# EAGLE design board (EAGLE 8.6.0)
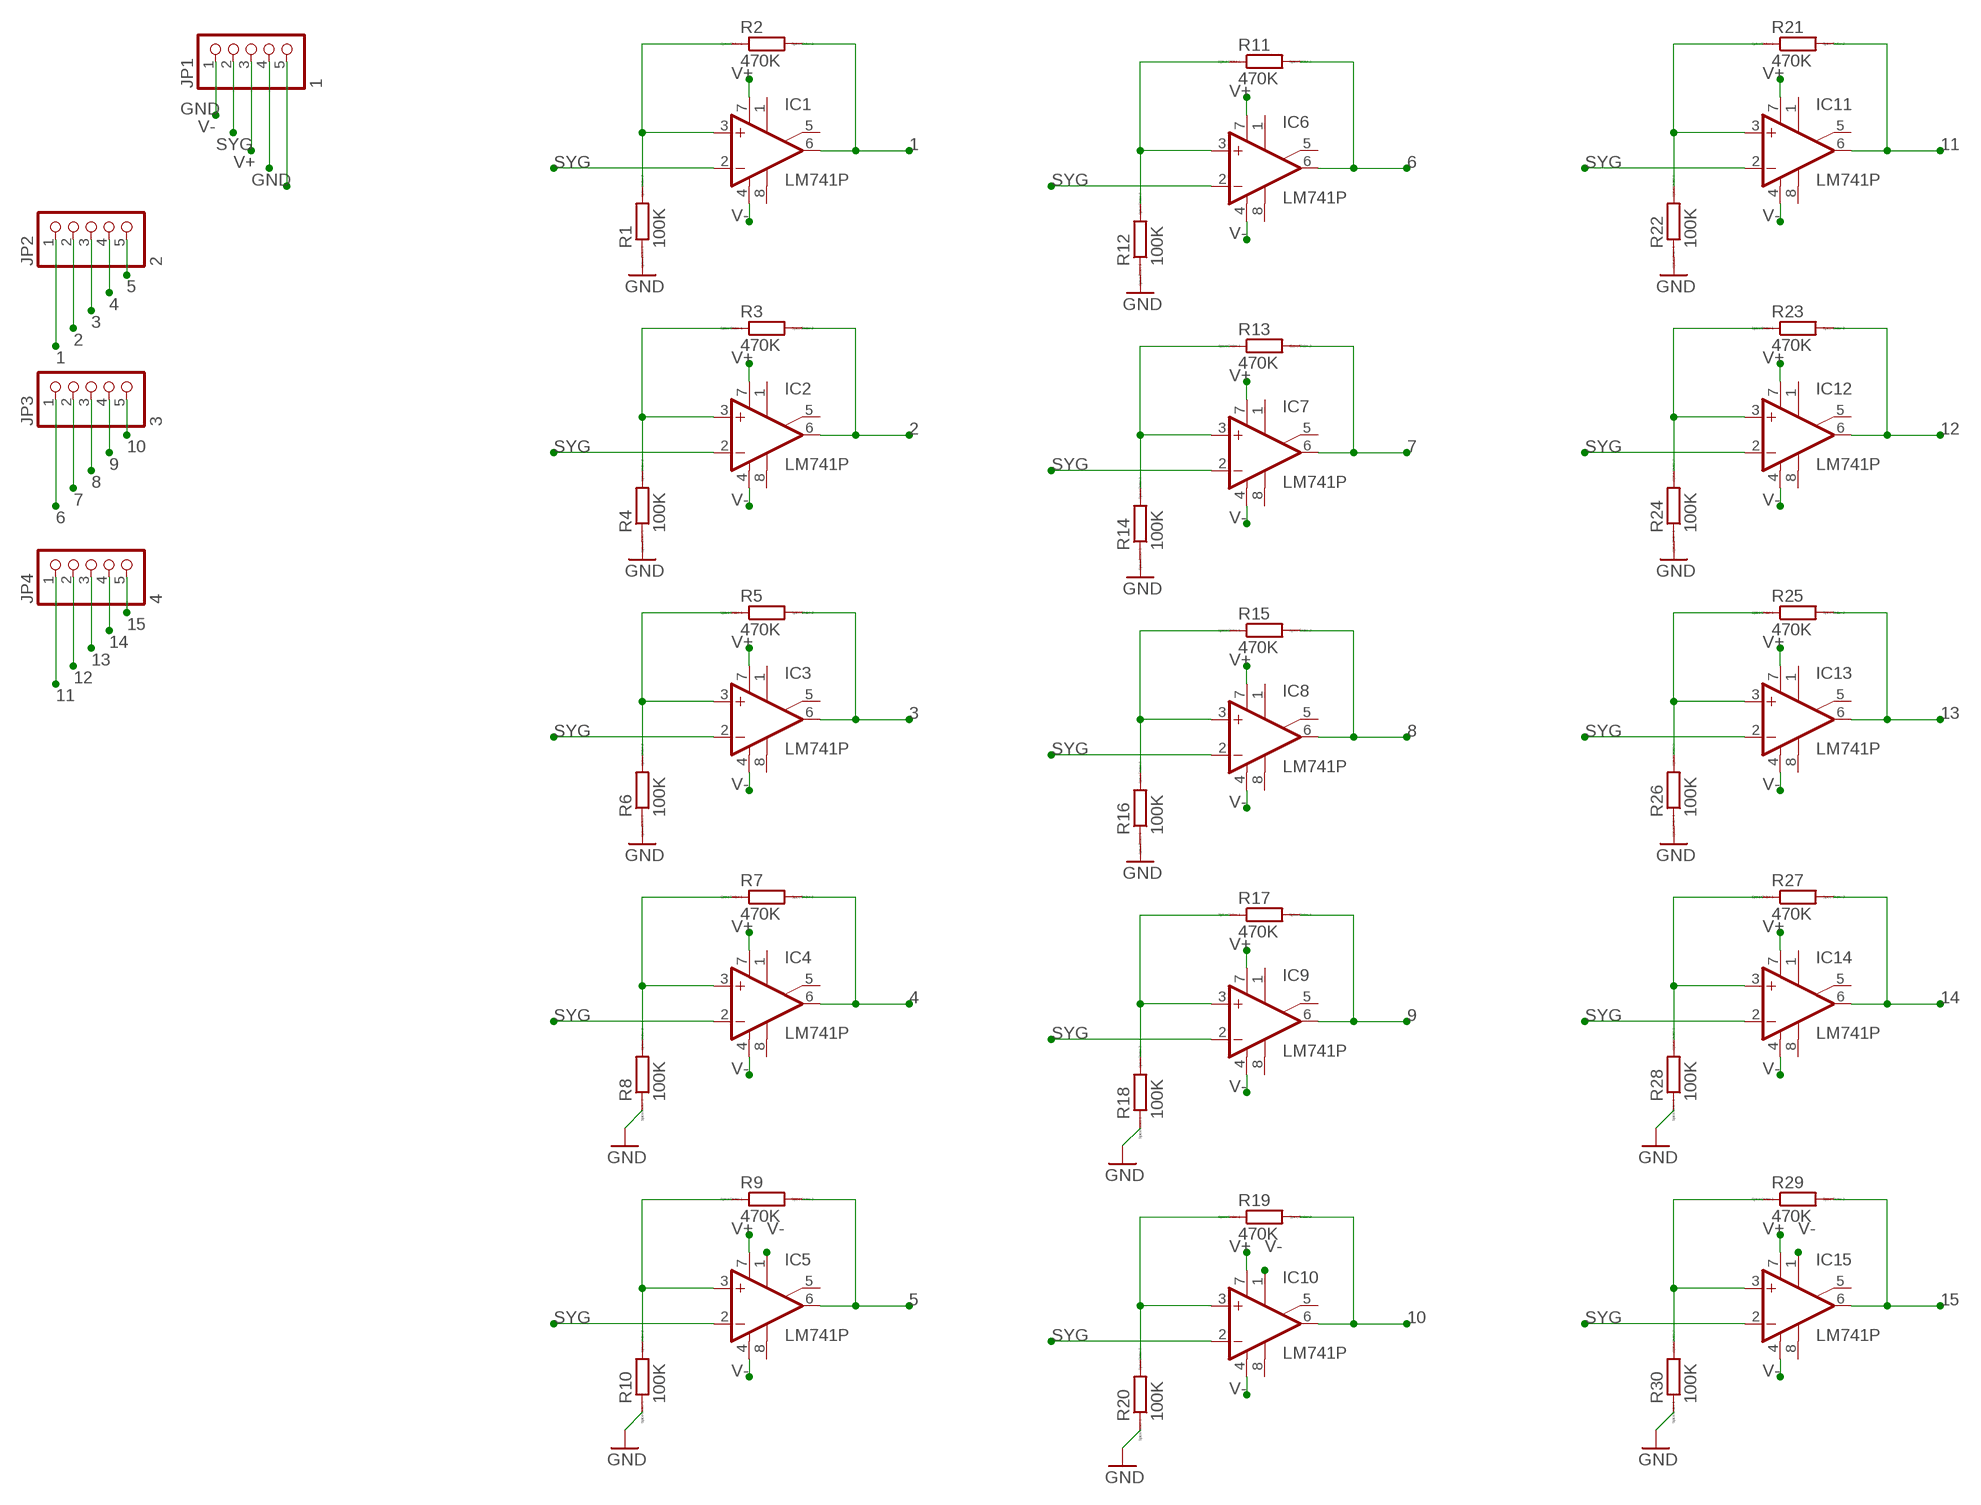
[diagram p0: schematic, sheet 1]

## Parts
IC1  LM741P  [DIL08]
IC2  LM741P  [DIL08]
IC3  LM741P  [DIL08]
IC4  LM741P  [DIL08]
IC5  LM741P  [DIL08]
IC6  LM741P  [DIL08]
IC7  LM741P  [DIL08]
IC8  LM741P  [DIL08]
IC9  LM741P  [DIL08]
IC10  LM741P  [DIL08]
IC11  LM741P  [DIL08]
IC12  LM741P  [DIL08]
IC13  LM741P  [DIL08]
IC14  LM741P  [DIL08]
IC15  LM741P  [DIL08]
JP1  1  PINHD-1X5  [1X05]
JP2  2  PINHD-1X5  [1X05]
JP3  3  PINHD-1X5  [1X05]
JP4  4  PINHD-1X5  [1X05]
R1  100K  R0204/7  [0204/7]
R2  470K  R0204/7  [0204/7]
R3  470K  R0204/7  [0204/7]
R4  100K  R0204/7  [0204/7]
R5  470K  R0204/7  [0204/7]
R6  100K  R0204/7  [0204/7]
R7  470K  R0204/7  [0204/7]
R8  100K  R0204/7  [0204/7]
R9  470K  R0204/7  [0204/7]
R10  100K  R0204/7  [0204/7]
R11  470K  R0204/7  [0204/7]
R12  100K  R0204/7  [0204/7]
R13  470K  R0204/7  [0204/7]
R14  100K  R0204/7  [0204/7]
R15  470K  R0204/7  [0204/7]
R16  100K  R0204/7  [0204/7]
R17  470K  R0204/7  [0204/7]
R18  100K  R0204/7  [0204/7]
R19  470K  R0204/7  [0204/7]
R20  100K  R0204/7  [0204/7]
R21  470K  R0204/7  [0204/7]
R22  100K  R0204/7  [0204/7]
R23  470K  R0204/7  [0204/7]
R24  100K  R0204/7  [0204/7]
R25  470K  R0204/7  [0204/7]
R26  100K  R0204/7  [0204/7]
R27  470K  R0204/7  [0204/7]
R28  100K  R0204/7  [0204/7]
R29  470K  R0204/7  [0204/7]
R30  100K  R0204/7  [0204/7]

## Nets
1: IC1.6(OUT) JP2.1 R2.2
2: IC2.6(OUT) JP2.2 R3.2
3: IC3.6(OUT) JP2.3 R5.2
4: IC4.6(OUT) JP2.4 R7.2
5: IC5.6(OUT) JP2.5 R9.2
6: IC6.6(OUT) JP3.1 R11.2
7: IC7.6(OUT) JP3.2 R13.2
8: IC8.6(OUT) JP3.3 R15.2
9: IC9.6(OUT) JP3.4 R17.2
10: IC10.6(OUT) JP3.5 R19.2
11: IC11.6(OUT) JP4.1 R21.2
12: IC12.6(OUT) JP4.2 R23.2
13: IC13.6(OUT) JP4.3 R25.2
14: IC14.6(OUT) JP4.4 R27.2
15: IC15.6(OUT) JP4.5 R29.2
GND: JP1.1 JP1.5 R1.1 R4.1 R6.1 R8.1 R10.1 R12.1 R14.1 R16.1 R18.1 R20.1 R22.1 R24.1 R26.1 R28.1 R30.1
N$1: IC2.3(+IN) R3.1 R4.2
N$2: IC1.3(+IN) R1.2 R2.1
N$3: IC3.3(+IN) R5.1 R6.2
N$4: IC4.3(+IN) R7.1 R8.2
N$5: IC5.3(+IN) R9.1 R10.2
N$6: IC6.3(+IN) R11.1 R12.2
N$7: IC7.3(+IN) R13.1 R14.2
N$8: IC8.3(+IN) R15.1 R16.2
N$9: IC9.3(+IN) R17.1 R18.2
N$10: IC10.3(+IN) R19.1 R20.2
N$11: IC11.3(+IN) R21.1 R22.2
N$12: IC12.3(+IN) R23.1 R24.2
N$13: IC13.3(+IN) R25.1 R26.2
N$14: IC14.3(+IN) R27.1 R28.2
N$15: IC15.3(+IN) R29.1 R30.2
SYG: IC1.2(-IN) IC2.2(-IN) IC3.2(-IN) IC4.2(-IN) IC5.2(-IN) IC6.2(-IN) IC7.2(-IN) IC8.2(-IN) IC9.2(-IN) IC10.2(-IN) IC11.2(-IN) IC12.2(-IN) IC13.2(-IN) IC14.2(-IN) IC15.2(-IN) JP1.3
V+: IC1.7(V+) IC2.7(V+) IC3.7(V+) IC4.7(V+) IC5.7(V+) IC6.7(V+) IC7.7(V+) IC8.7(V+) IC9.7(V+) IC10.7(V+) IC11.7(V+) IC12.7(V+) IC13.7(V+) IC14.7(V+) IC15.7(V+) JP1.4
V-: IC1.4(V-) IC2.4(V-) IC3.4(V-) IC4.4(V-) IC5.1(ON1) IC5.4(V-) IC6.4(V-) IC7.4(V-) IC8.4(V-) IC9.4(V-) IC10.1(ON1) IC10.4(V-) IC11.4(V-) IC12.4(V-) IC13.4(V-) IC14.4(V-) IC15.1(ON1) IC15.4(V-) JP1.2
Unconnected: IC1.1(ON1) IC1.5(ON2) IC1.8(OPT) IC2.1(ON1) IC2.5(ON2) IC2.8(OPT) IC3.1(ON1) IC3.5(ON2) IC3.8(OPT) IC4.1(ON1) IC4.5(ON2) IC4.8(OPT) IC5.5(ON2) IC5.8(OPT) IC6.1(ON1) IC6.5(ON2) IC6.8(OPT) IC7.1(ON1) IC7.5(ON2) IC7.8(OPT) IC8.1(ON1) IC8.5(ON2) IC8.8(OPT) IC9.1(ON1) IC9.5(ON2) IC9.8(OPT) IC10.5(ON2) IC10.8(OPT) IC11.1(ON1) IC11.5(ON2) IC11.8(OPT) IC12.1(ON1) IC12.5(ON2) IC12.8(OPT) IC13.1(ON1) IC13.5(ON2) IC13.8(OPT) IC14.1(ON1) IC14.5(ON2) IC14.8(OPT) IC15.5(ON2) IC15.8(OPT)

## Library data of the parts
IC1-IC15 = linear:*741: OP AMP
JP1-JP4 = pinhead:PINHD-1X5: PIN HEADER
R1-R30 = eagle-ltspice:R: RESISTOR, European symbol; SPICEMODEL: NONE; SPICEPREFIX: R

## Board
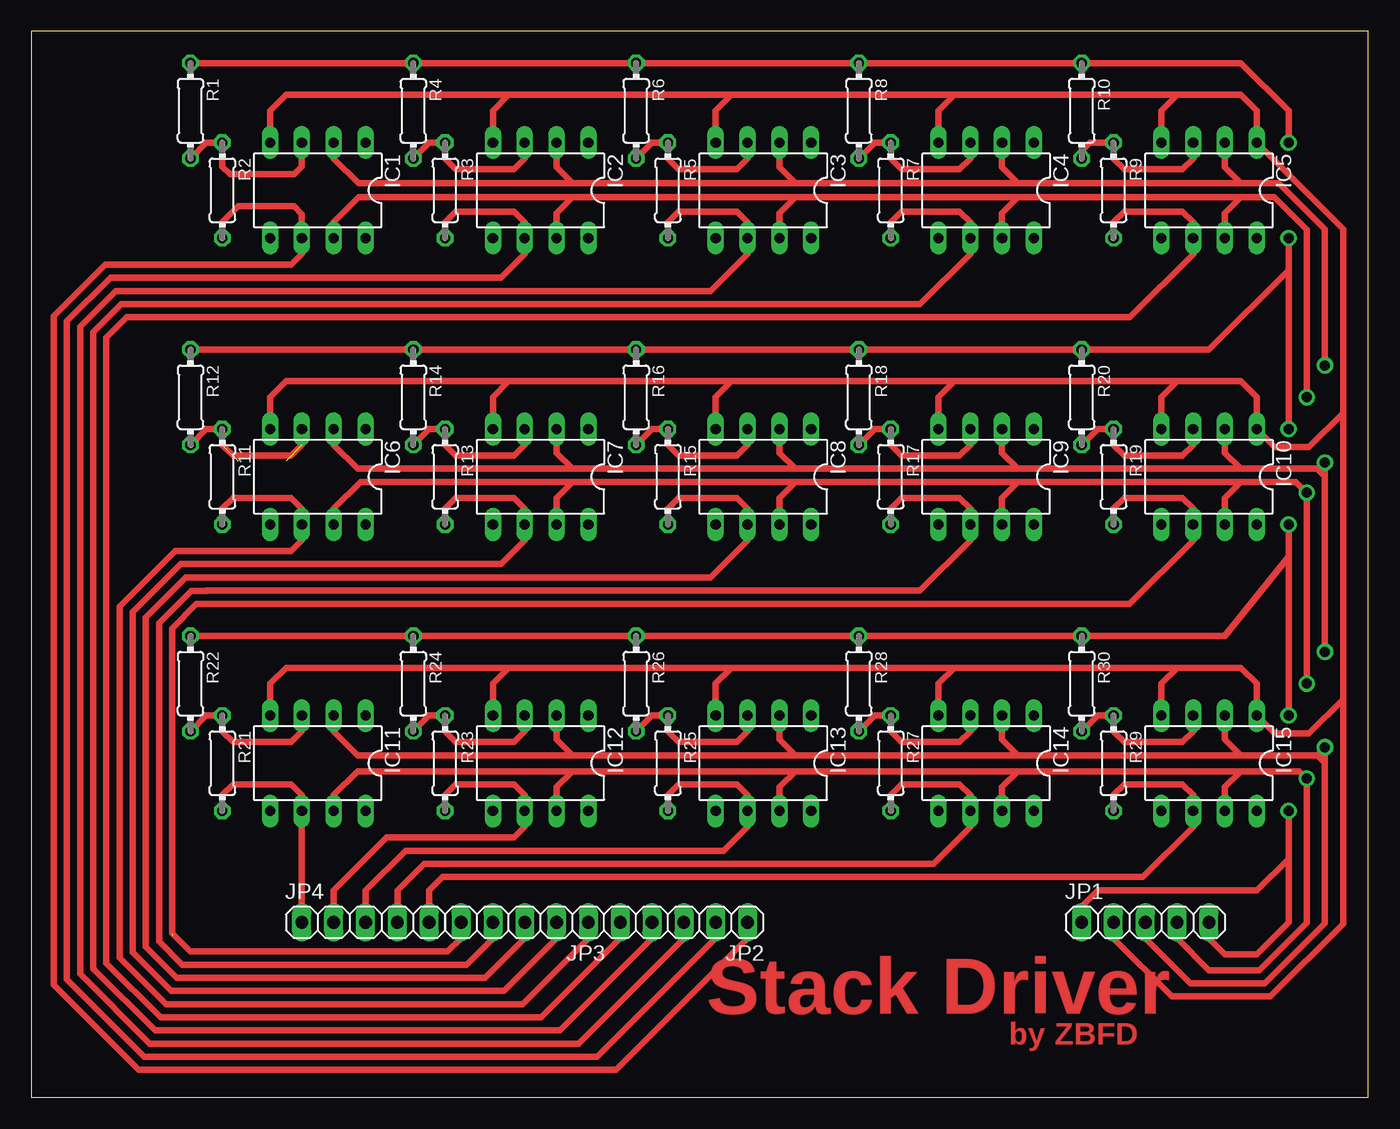
[diagram p1: board, top side]
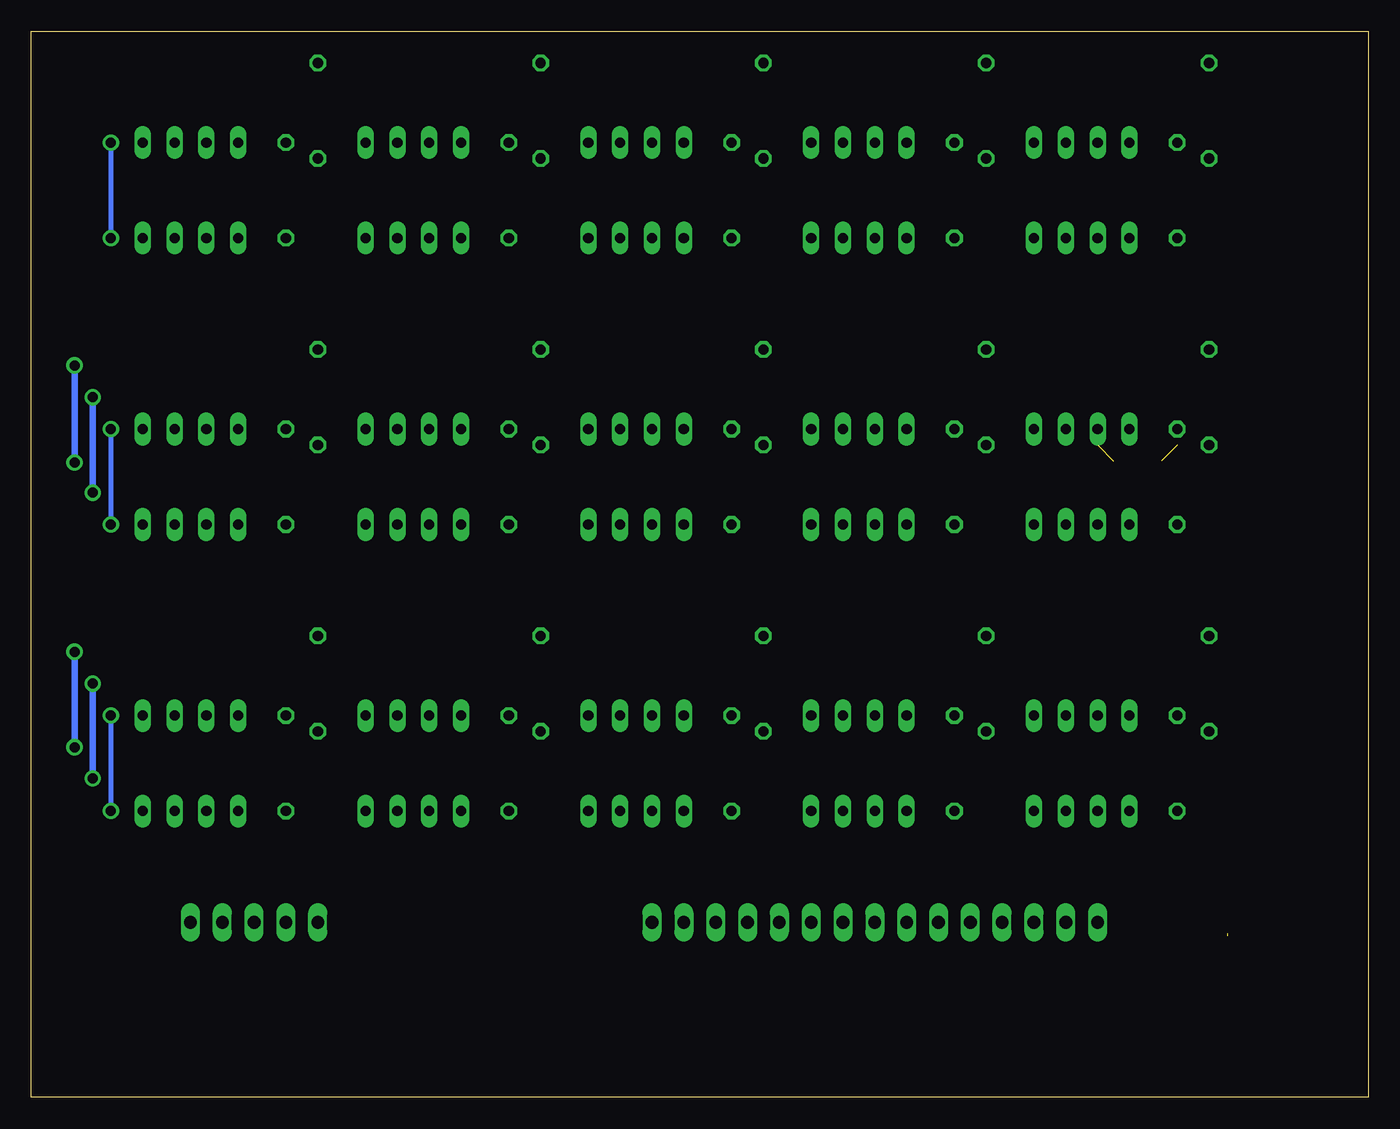
[diagram p2: board, bottom side, seen from below]

Size 106.68 x 85.08 mm. Coordinates in mm from the lower left corner, seen from the top.
Outline: 0,0 106.68,0 106.68,85.08 0,85.08 0,0
Copper layers (1*16): Top 0.035mm / dielectric 1.5mm / Bottom 0.035mm
Design rules "default *": minimum track width 6mil, minimum drill 0.35mm, track to track 0.55mm, track to pad 0.55mm, pad to pad 0.55mm, via to via 0.55mm, smd to smd 6mil, copper to edge 40mil, drill to drill 6mil, minimum pad ring 10mil, minimum via ring 8mil, stop-mask expansion 4mil, vias tented up to drill 0mil, thermal gap 10mil

### Footprints (pad centres in the part's own frame; a part is rotated, then mirrored left to right if it is on the bottom)
DIL08 = drill 0.813 long: 1 -3.81,-3.81; 2 -1.27,-3.81; 3 1.27,-3.81; 4 3.81,-3.81; 5 3.81,3.81; 6 1.27,3.81; 7 -1.27,3.81; 8 -3.81,3.81
1X05 = drill 1.016 long: 1 -5.08,0; 2 -2.54,0; 3 0,0; 4 2.54,0; 5 5.08,0
0204/7 = drill 0.813 octagon: 1 -3.81,0; 2 3.81,0

### Placement (x,y rotation side)
IC1  22.86,72.39 180 top
IC2  40.64,72.39 180 top
IC3  58.42,72.39 180 top
IC4  76.2,72.39 180 top
IC5  93.98,72.39 180 top
IC6  22.86,49.53 180 top
IC7  40.64,49.53 180 top
IC8  58.42,49.53 180 top
IC9  76.2,49.53 180 top
IC10  93.98,49.53 180 top
IC11  22.86,26.67 180 top
IC12  40.64,26.67 180 top
IC13  58.42,26.67 180 top
IC14  76.2,26.67 180 top
IC15  93.98,26.67 180 top
JP1  88.9,13.97 0 top
JP2  52.07,13.97 180 top
JP3  39.37,13.97 180 top
JP4  26.67,13.97 0 top
R1  12.7,78.74 270 top
R2  15.24,72.39 270 top
R3  33.02,72.39 270 top
R4  30.48,78.74 270 top
R5  50.8,72.39 270 top
R6  48.26,78.74 270 top
R7  68.58,72.39 270 top
R8  66.04,78.74 270 top
R9  86.36,72.39 270 top
R10  83.82,78.74 270 top
R11  15.24,49.53 270 top
R12  12.7,55.88 270 top
R13  33.02,49.53 270 top
R14  30.48,55.88 270 top
R15  50.8,49.53 270 top
R16  48.26,55.88 270 top
R17  68.58,49.53 270 top
R18  66.04,55.88 270 top
R19  86.36,49.53 270 top
R20  83.82,55.88 270 top
R21  15.24,26.67 270 top
R22  12.7,33.02 270 top
R23  33.02,26.67 270 top
R24  30.48,33.02 270 top
R25  50.8,26.67 270 top
R26  48.26,33.02 270 top
R27  68.58,26.67 270 top
R28  66.04,33.02 270 top
R29  86.36,26.67 270 top
R30  83.82,33.02 270 top

### Tracks (layer width: path | path; a pad name or v marks a point on that pad's centre or on a via)
1
  Top 0.5: R2.2 15.24,69.85 16.51,71.12 20.95,71.12 21.59,70.48 IC1.6 21.59,67.31 20.74,66.46 5.88,66.46 1.79,62.37 1.79,10.16 1.79,8.98 8.57,2.2 46.65,2.2 55.88,11.43 56.52,12.07 57.15,12.7 JP2.1
2
  Top 0.5: R3.2 33.02,69.85 33.87,70.7 38.52,70.7 39.37,69.85 IC2.6 39.37,67.31 37.47,65.41 6.31,65.41 2.84,61.93 2.84,10.16 2.84,9.41 9.01,3.25 45.16,3.25 53.34,11.43 53.98,12.07 54.61,12.7 JP2.2
3
  Top 0.4: 57.15,67.31 IC3.6 57.05,68.58
  Top 0.5: R5.2 50.8,69.85 51.65,70.7 56.3,70.7 57.15,69.85 IC3.6 | 57.15,67.31 54.2,64.36 6.75,64.36 3.89,61.5 3.89,10.16 3.89,9.85 9.44,4.3 43.67,4.3 52.07,12.7 JP2.3
4
  Top 0.5: R7.2 68.58,69.85 69.43,70.7 74.08,70.7 74.93,69.85 IC4.6 74.93,67.31 70.93,63.31 7.19,63.31 4.94,61.06 4.94,11.43 4.94,10.28 9.87,5.35 42.18,5.35 48.26,11.43 48.9,12.07 49.53,12.7 JP2.4
5
  Top 0.5: R9.2 86.36,69.85 87.21,70.7 91.86,70.7 92.71,69.85 IC5.6 92.71,67.31 87.66,62.26 7.62,62.26 5.99,60.63 5.99,11.43 5.99,10.72 10.31,6.4 40.69,6.4 45.72,11.43 46.36,12.07 46.99,12.7 JP2.5
6
  Top 0.5: R11.2 15.24,46.99 16.09,47.84 20.74,47.84 21.59,46.99 IC6.6 21.59,44.45 20.74,43.6 11.46,43.6 7.04,39.17 7.04,11.43 7.04,11.15 10.74,7.45 39.2,7.45 44.45,12.7 JP3.1
7
  Top 0.5: R13.2 33.02,46.99 33.87,47.84 38.52,47.84 39.37,46.99 IC7.6 39.37,44.45 37.47,42.55 11.9,42.55 8.09,38.74 8.09,11.59 11.18,8.5 37.71,8.5 41.91,12.7 JP3.2
8
  Top 0.5: R15.2 50.8,46.99 51.65,47.84 56.3,47.84 57.15,46.99 IC8.6 57.15,44.45 54.2,41.5 12.33,41.5 9.14,38.3 9.14,12.7 9.14,12.02 11.61,9.55 36.22,9.55 39.37,12.7 JP3.3
9
  Top 0.5: R17.2 68.58,46.99 69.43,47.84 74.08,47.84 74.93,46.99 IC9.6 74.93,44.45 70.93,40.45 13.97,40.45 13.94,40.42 12.74,40.42 10.19,37.87 10.19,12.46 12.05,10.6 29.21,10.6 34.73,10.6 36.83,12.7 JP3.4
10  (1 unrouted)
  Top 0.5: R19.2 86.36,46.99 87.21,47.84 91.86,47.84 92.71,46.99 IC10.6 92.71,44.45 87.63,39.37 13.17,39.37 11.24,37.43 11.24,13.08 12.67,11.65 33.24,11.65 34.29,12.7 JP3.5
11
  Top 0.4: 21.59,24.13 IC11.6
  Top 0.5: R21.2 15.24,24.13 16.09,24.98 20.74,24.98 21.59,24.13 | IC11.6 JP4.1
12
  Top 0.4: 39.37,24.13 IC12.6
  Top 0.5: R23.2 33.02,24.13 33.87,24.98 38.52,24.98 39.37,24.13 | IC12.6 39.37,21.59 38.52,20.74 28.36,20.74 24.13,16.51 JP4.2
13
  Top 0.5: R25.2 50.8,24.13 51.65,24.98 56.3,24.98 57.15,24.13 IC13.6 57.15,21.59 55.25,19.69 29.85,19.69 26.67,16.51 JP4.3
14
  Top 0.4: 74.93,24.13 IC14.6
  Top 0.5: R27.2 68.58,24.13 69.43,24.98 74.08,24.98 74.93,24.13 | IC14.6 74.93,21.59 71.98,18.64 31.34,18.64 29.21,16.51 JP4.4
15
  Top 0.5: R29.2 86.36,24.13 87.21,24.98 91.86,24.98 92.71,24.13 IC15.6 92.71,21.59 88.71,17.59 32.83,17.59 31.75,16.51 JP4.5
GND  (via drill 0.8 pad 1.3)
  Top 0.4: R8.1 R10.1 | 93.98,59.69 R20.1 R18.1 R16.1 R14.1 R12.1
  Top 0.5: R8.1 R6.1 R4.1 R1.1 R10.1 96.52,82.55 100.33,78.74 v100.33,76.2 | v100.33,53.34 v100.33,68.58 100.33,66.04 93.98,59.69 R12.1 | 100.33,43.18 95.25,36.83 R30.1 R28.1 R26.1 R24.1 R22.1 | 100.33,43.18 v100.33,45.72 | 100.33,43.18 v100.33,30.48 | v100.33,22.86 100.33,19.05 | 100.33,19.05 97.79,16.51 85.09,16.51 83.82,15.24 JP1.1 83.82,12.7 | JP1.5 93.98,12.7 95.25,11.43 97.79,11.43 100.33,13.97 100.33,19.05
  Bottom 0.4: v100.33,53.34 v100.33,45.72 | v100.33,30.48 v100.33,22.86 | v100.33,76.2 v100.33,68.58
N$1
  Top 0.5: IC2.3 39.37,74.93 38.52,74.08 33.87,74.08 33.02,74.93 R3.1 31.75,76.2 R4.2
N$2
  Top 0.5: IC1.3 21.59,74.3 20.95,73.66 15.88,73.66 15.24,74.3 R2.1 13.97,76.2 R1.2
N$3
  Top 0.5: R6.2 49.53,76.2 R5.1 50.8,74.93 51.65,74.08 56.3,74.08 57.15,74.93 IC3.3
N$4
  Top 0.4: 74.93,74.93 IC4.3
  Top 0.5: 74.93,74.93 74.08,74.08 69.43,74.08 68.58,74.93 R7.1 67.31,76.2 R8.2
N$5
  Top 0.4: 83.82,75.56 84.14,75.88
  Top 0.5: IC5.3 92.71,74.93 91.86,74.08 87.21,74.08 86.36,74.93 R9.1 84.45,76.2 84.14,75.88 | R10.2 83.82,75.56
N$6  (2 unrouted)
  Top 0.4: IC6.3 21.59,52.07
  Top 0.5: R12.2 13.97,53.34 R11.1 15.24,52.07 16.09,51.22 20.74,51.22 21.59,52.07
N$7
  Top 0.5: R14.2 31.75,53.34 R13.1 33.02,52.07 33.87,51.22 38.52,51.22 39.37,52.07 IC7.3
N$8
  Top 0.5: R16.2 49.53,53.34 R15.1 50.8,52.07 51.65,51.22 56.3,51.22 57.15,52.07 IC8.3
N$9
  Top 0.5: R18.2 67.31,53.34 R17.1 68.58,52.07 69.43,51.22 74.08,51.22 74.93,52.07 IC9.3
N$10
  Top 0.4: IC10.3 92.71,52.07
  Top 0.5: R20.2 85.09,53.34 R19.1 86.36,52.07 87.21,51.22 91.86,51.22 92.71,52.07
N$11
  Top 0.5: R22.2 13.97,30.48 R21.1 15.24,29.21 16.09,28.36 20.74,28.36 21.59,29.21 IC11.3
N$12
  Top 0.5: R24.2 31.75,30.48 R23.1 33.02,29.21 33.87,28.36 38.52,28.36 39.37,29.21 IC12.3
N$13
  Top 0.5: R26.2 49.53,30.48 R25.1 50.8,29.21 51.65,28.36 56.3,28.36 57.15,29.21 IC13.3
N$14
  Top 0.5: R28.2 67.31,30.48 R27.1 68.58,29.21 69.43,28.36 74.08,28.36 74.93,29.21 IC14.3
N$15
  Top 0.4: 92.71,29.21 IC15.3
  Top 0.5: R30.2 85.09,30.48 R29.1 86.36,29.21 87.21,28.36 91.86,28.36 92.71,29.21
SYG  (via drill 0.8 pad 1.3)
  Top 0.5: IC1.2 24.13,74.93 26.11,72.95 43.18,72.95 | 43.18,72.95 60.96,72.95 | 60.96,72.95 78.74,72.95 | 78.74,72.95 96.52,72.95 | 96.52,72.95 99.55,72.95 103.23,69.27 v103.23,58.42 | 41.91,74.93 IC2.2 41.91,74.22 43.18,72.95 | IC3.2 59.69,74.22 60.96,72.95 | 78.74,72.95 77.47,74.22 IC4.2 | 96.52,72.95 95.25,74.22 IC5.2 | IC6.2 24.13,52.07 26.03,50.17 43.18,50.17 | 43.18,50.17 60.96,50.17 | 60.96,50.17 78.74,50.17 | 78.74,50.17 96.52,50.17 | 96.52,50.17 102.73,50.17 | 102.73,50.17 102.73,50.03 103.23,49.53 | 103.23,49.53 v103.23,50.67 102.73,50.17 | 43.18,50.17 41.91,51.44 IC7.2 | 60.96,50.17 59.69,51.44 IC8.2 | 78.74,50.17 77.47,51.44 IC9.2 | 96.52,50.17 95.25,51.44 IC10.2 | 103.23,49.53 v103.23,35.56 | 43.18,27.31 60.96,27.31 | 103.23,27.49 v103.23,27.94 | 60.96,27.31 59.69,28.58 IC13.2 | IC12.2 41.91,28.58 43.18,27.31 | JP1.3 88.9,12.7 92.49,9.11 98.44,9.11 103.23,13.9 103.23,26.68 | 60.96,27.31 78.74,27.31 | 78.74,27.31 96.52,27.31 | 96.52,27.31 102.6,27.31 | 102.6,27.31 v103.23,27.94 | 78.74,27.31 77.47,28.58 IC14.2 | IC15.2 95.25,28.58 96.52,27.31 | v103.23,27.94 103.23,26.68 | 103.23,26.68 102.6,27.31 | IC11.2 24.13,29.21 26.03,27.31 43.18,27.31
  Bottom 0.5: v103.23,58.42 v103.23,50.67 | v103.23,35.56 v103.23,27.94
V+  (via drill 0.8 pad 1.3)
  Top 0.4: IC11.7 24.03,22.86
  Top 0.5: IC1.7 24.13,69.85 26.13,71.85 43.18,71.85 | 43.18,71.85 60.96,71.85 | 41.91,69.85 IC2.7 41.91,70.58 43.18,71.85 | 60.96,71.85 59.69,70.58 IC3.7 | 60.96,71.85 78.74,71.85 | 78.74,71.85 96.52,71.85 | 78.74,71.85 77.47,70.58 IC4.7 | 96.52,71.85 95.25,70.58 IC5.7 | 96.52,71.85 99.17,71.85 101.78,69.24 v101.78,55.88 | IC6.7 24.13,46.99 26.26,49.12 43.18,49.12 | 43.18,49.12 60.96,49.12 | 60.96,49.12 78.74,49.12 | 78.74,49.12 96.52,49.12 | 96.52,49.12 100.92,49.12 v101.78,48.26 v101.78,33.02 | 43.18,49.12 41.91,47.85 IC7.7 | 60.96,49.12 59.69,47.85 IC8.7 | 78.74,49.12 77.47,47.85 IC9.7 | 96.52,49.12 95.25,47.85 IC10.7 | IC11.7 24.13,24.13 26.03,26.03 43.18,26.03 | 43.18,26.03 60.96,26.03 | 60.96,26.03 78.74,26.03 | 78.74,26.03 96.52,26.03 | 96.52,26.03 101.2,26.03 v101.78,25.45 101.78,13.94 98,10.16 93.98,10.16 91.44,12.7 JP1.4 | 96.52,26.03 95.25,24.76 IC15.7 | 78.74,26.03 77.47,24.76 IC14.7 | 60.96,26.03 59.69,24.76 IC13.7 | 43.18,26.03 41.91,24.76 IC12.7
  Bottom 0.5: v101.78,55.88 v101.78,48.26 | v101.78,33.02 v101.78,25.45
V-
  Top 0.152: 86.36,13.92 86.36,13.75
  Top 0.4: IC3.4 54.61,78.11
  Top 0.5: IC1.4 19.05,78.74 20.32,80.01 38.1,80.01 | 91.44,80.01 96.52,80.01 97.79,78.74 IC5.1 104.68,69.31 104.68,54.61 | 91.44,80.01 73.66,80.01 | 73.66,80.01 55.88,80.01 | 55.88,80.01 38.1,80.01 | 38.1,80.01 36.83,78.74 IC2.4 | IC3.4 54.61,78.74 55.88,80.01 | IC4.4 72.39,78.74 73.66,80.01 | IC5.4 90.17,78.74 91.44,80.01 | 104.68,54.61 101.96,51.89 99.24,51.89 IC10.1 97.79,55.88 96.52,57.15 91.44,57.15 | IC6.4 19.05,55.88 20.32,57.15 38.1,57.15 | 38.1,57.15 55.88,57.15 | 55.88,57.15 73.66,57.15 | 73.66,57.15 91.44,57.15 | IC9.4 72.39,55.88 73.66,57.15 | IC10.4 90.17,55.88 91.44,57.15 | IC8.4 54.61,55.88 55.88,57.15 | IC7.4 36.83,55.88 38.1,57.15 | IC11.4 19.05,33.02 20.32,34.29 38.1,34.29 | 38.1,34.29 55.88,34.29 | 55.88,34.29 73.66,34.29 | 73.66,34.29 91.44,34.29 | 91.44,34.29 95.25,34.29 96.52,34.29 97.79,33.02 IC15.1 99.24,29.03 101.96,29.03 104.68,31.75 | IC15.4 90.17,33.02 91.44,34.29 | IC14.4 72.39,33.02 73.66,34.29 | IC13.4 54.61,33.02 55.88,34.29 | IC12.4 36.83,33.02 38.1,34.29 | 104.68,54.61 104.68,31.75 | 104.68,31.75 104.68,13.87 98.88,8.06 91,8.06 86.36,12.7 JP1.2 86.36,13.92

### Text on the board
Top: Stack Driver | by ZBFD